# EAGLE design i6 Dimmer (EAGLE 6.0)
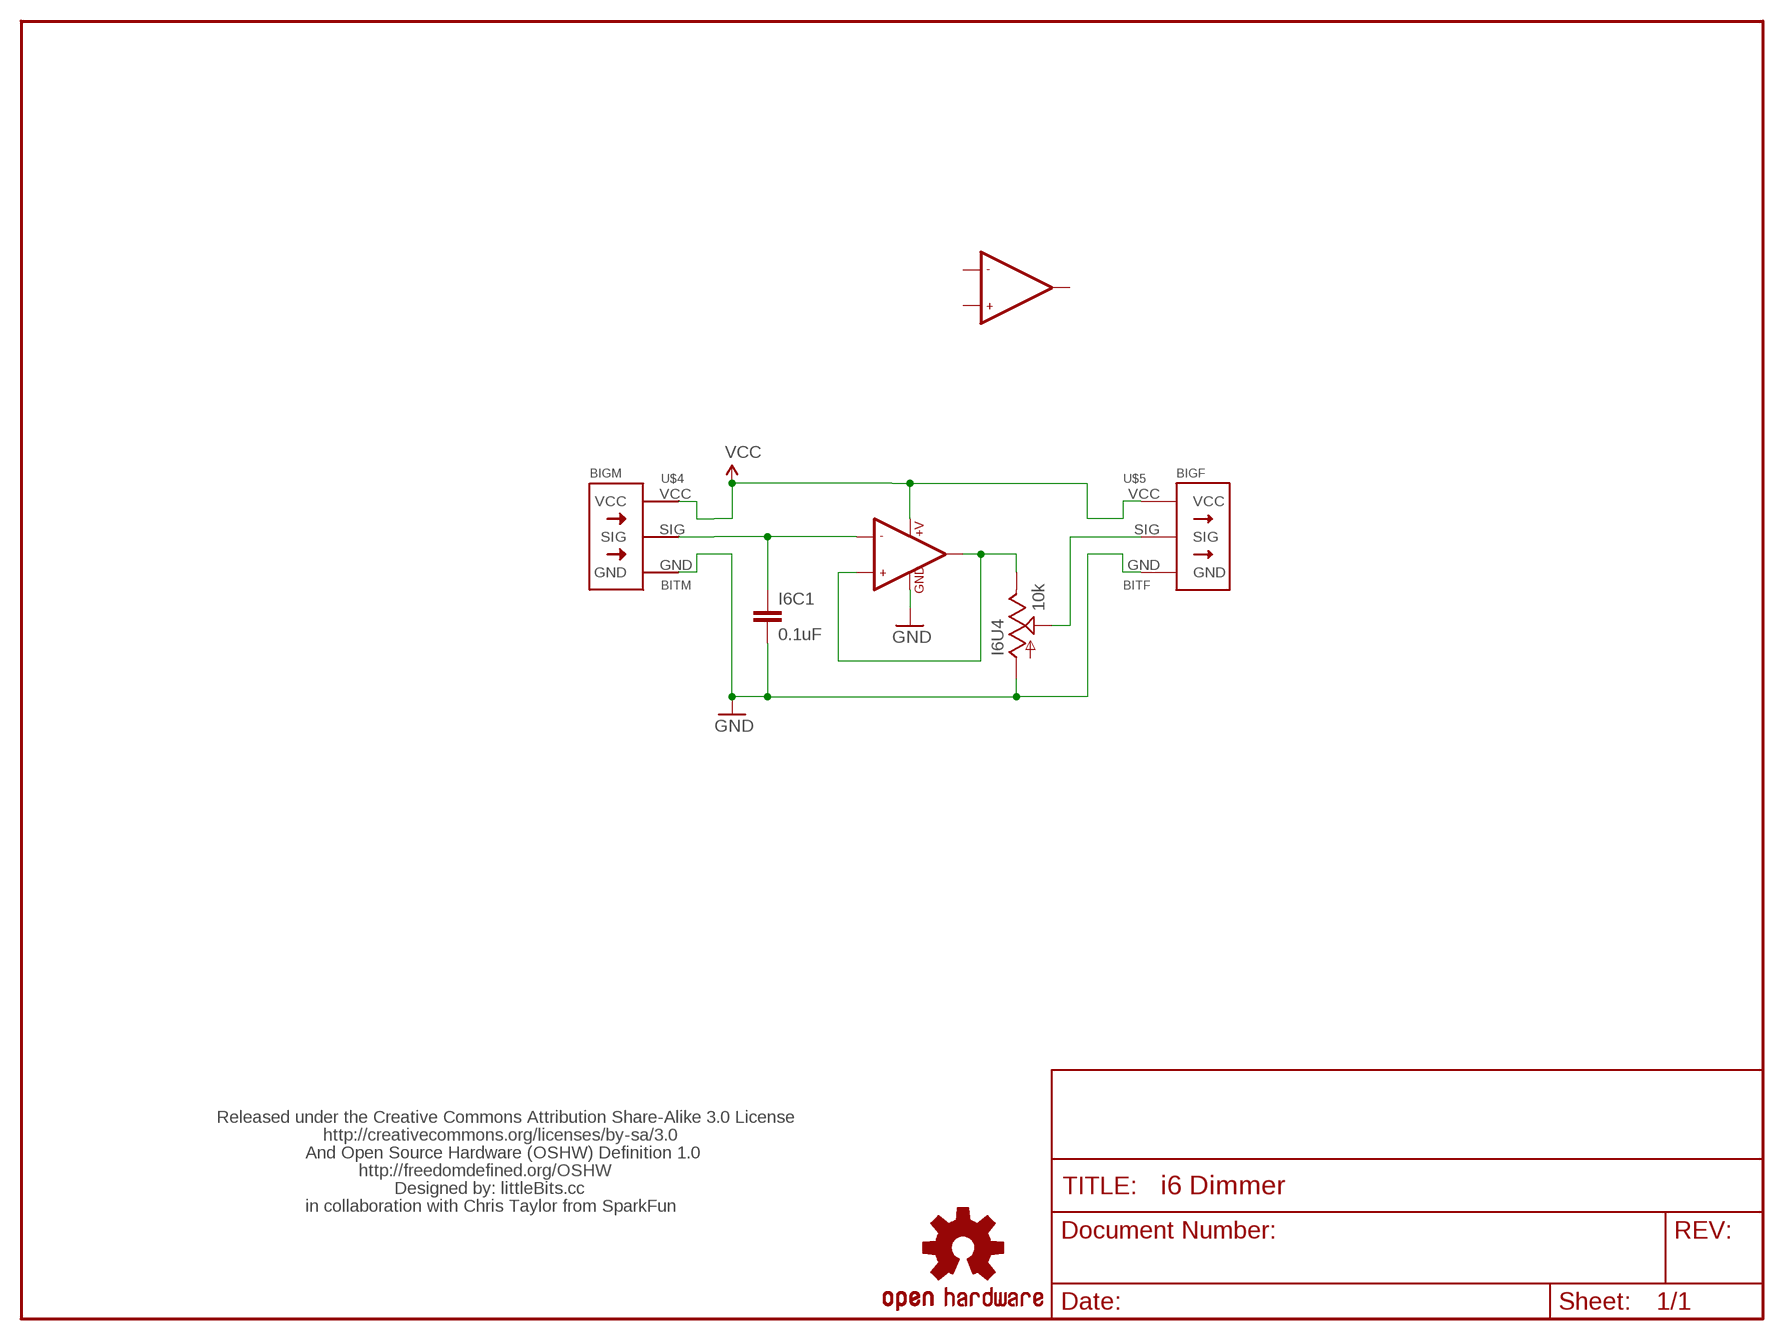
[diagram p0: schematic, sheet 1]

## Parts
I6C1  0.1uF  CAP1206  [1206]
I6U4  10k  POT  [ALPS_POT]
U$1  LB_CREDITS  [OSHWCREDIT]
U$2  LMV358  [SO08]
U$3  OSHW-LOGOL  [OSHW-LOGO-L]
U$4  BITM  [BITM]
U$5  BITF  [BITM]

## Nets
GND: I6C1.2 I6U4.P$3(A) U$2.4(GND) U$4.GND U$5.GND
N$1: I6U4.P$1(E) U$2.1(OUT1) U$2.3(+IN1)
POT: I6U4.P$2(S) U$5.SIG
SIG: I6C1.1 U$2.2(-IN1) U$4.SIG
VCC: U$2.8(+V) U$4.VCC U$5.VCC
Unconnected: U$2.5(+IN2) U$2.6(-IN2) U$2.7(OUT2)

## Library data of the parts
I6C1 = SparkFun:CAP: Capacitor Standard 0603 ceramic capacitor, and 0.1" leaded capacitor.
I6U4 = SparkFun:POT
U$1 = LITTLEBITS:LB_CREDITS
U$2 = SparkFun:LMV358
U$3 = SparkFun:OSHW-LOGO: Open Source Hardware Logo This logo indicates the piece of hardware it is found on incorporates a OSHW license and/or adheres to the definition of open source hardware found here: http://freedomdefined.org/OSHW
U$4 = radames:BITM
U$5 = radames:BITF

## Board
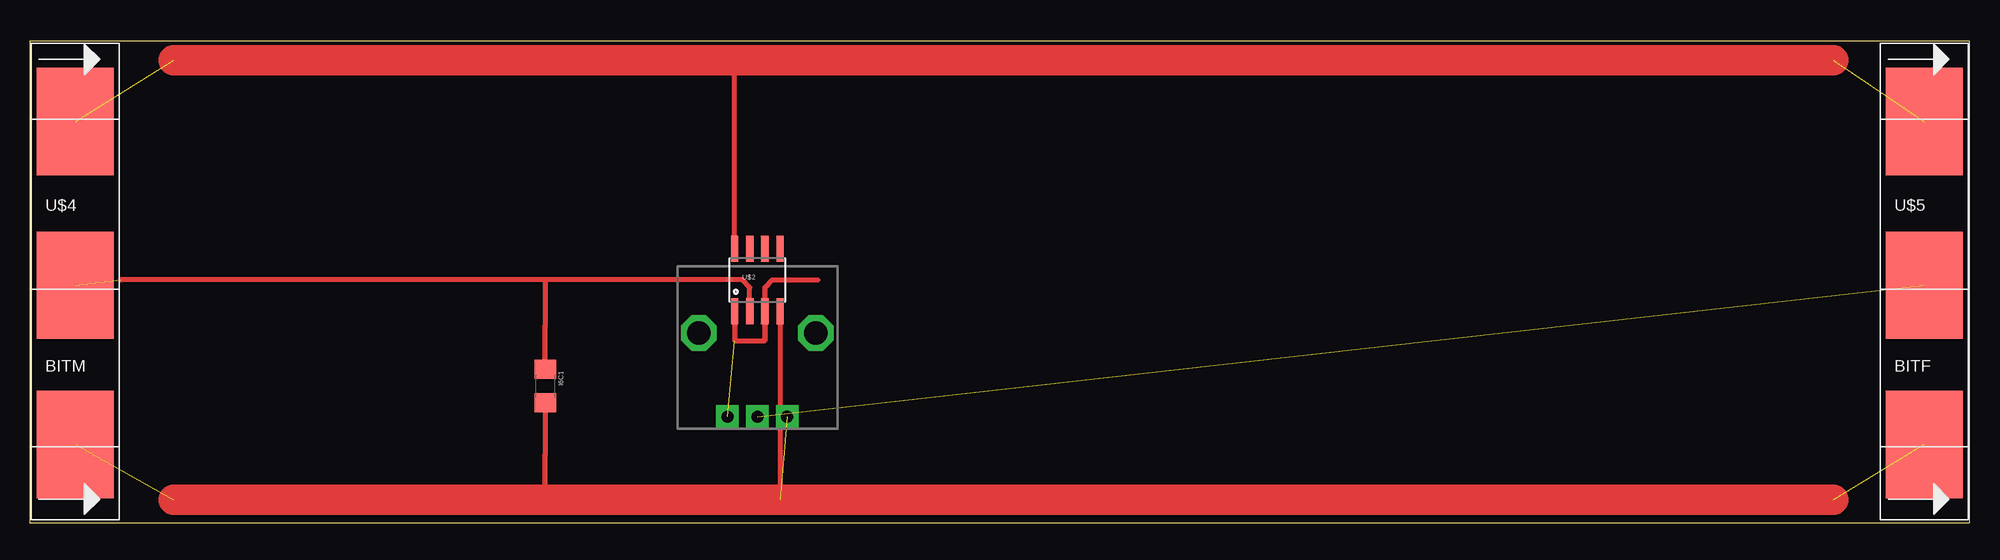
[diagram p1: board, top side]

Size 162.54 x 40.31 mm. Coordinates in mm from the lower left corner, seen from the top.
Outline: 0,0 162.54,0 162.54,40.31 0,40.31 0,0
Copper layers (1*16): Top 0.035mm / dielectric 1.5mm / Bottom 0.035mm
Design rules: minimum track width 10mil, minimum drill 24mil, track to track 8mil, track to pad 8mil, pad to pad 8mil, via to via 8mil, smd to smd 8mil, copper to edge 40mil, drill to drill 8mil, minimum pad ring 10mil, minimum via ring 8mil, stop-mask expansion 4mil, vias tented up to drill 0mil, thermal gap 10mil

### Footprints (pad centres in the part's own frame; a part is rotated, then mirrored left to right if it is on the bottom)
1206 = smd 1.6 x 1.8: 1 -1.4,0; 2 1.4,0
ALPS_POT = drill 1 pad 1.88 square: P$1 7,-2.5; P$2 7,0; P$3 7,2.5 | drill 2 octagon: P$4 0,-4.9; P$5 0,4.9
SO08 = smd 0.61 x 2.21: 1 -1.905,-2.616; 2 -0.635,-2.616; 3 0.635,-2.616; 4 1.905,-2.616; 5 1.905,2.616; 6 0.635,2.616; 7 -0.635,2.616; 8 -1.905,2.616
BITM = smd 6.452 x 8.992: GND 3.81,-13.145; SIG 3.81,0.191; VCC 3.81,13.906

### Placement (x,y rotation side)
I6C1  43.18,11.43 270 top
I6U4  60.96,15.88 270 top
U$1  -48.26,1.27 0 top  (outside the outline)
U$2  60.96,20.32 0 top
U$3  -41.91,34.29 0 top  (outside the outline)
U$4  0,19.68 0 top
U$5  154.94,19.68 0 top

### Tracks (layer width: path | path; a pad name or v marks a point on that pad's centre or on a via)
GND  (3 unrouted)
  Top 0.406: I6C1.2 43.18,5.71 43.18,1.91 | U$2.4 62.87,1.91 | 73.62,1.95 73.66,1.91
  Top 2.54: 12.06,1.91 43.18,1.91 62.87,1.91 73.66,1.91 151.13,1.91
N$1  (1 unrouted)
  Top 0.406: U$2.3 61.59,15.24 | U$2.1 59.05,15.24 61.59,15.24 | 61.59,15.24 61.59,19.68 62.23,20.32 66.04,20.32
POT  (1 unrouted)
SIG  (1 unrouted)
  Top 0.406: I6C1.1 43.18,16.51 43.18,20.32 | U$2.2 60.33,19.68 59.69,20.32 43.18,20.32 | 43.18,20.32 7.62,20.32
VCC  (2 unrouted)
  Top 0.406: U$2.8 59.05,38.73
  Top 2.54: 12.06,38.73 59.05,38.73 151.13,38.73